# EAGLE schematic Control (EAGLE 6.4)
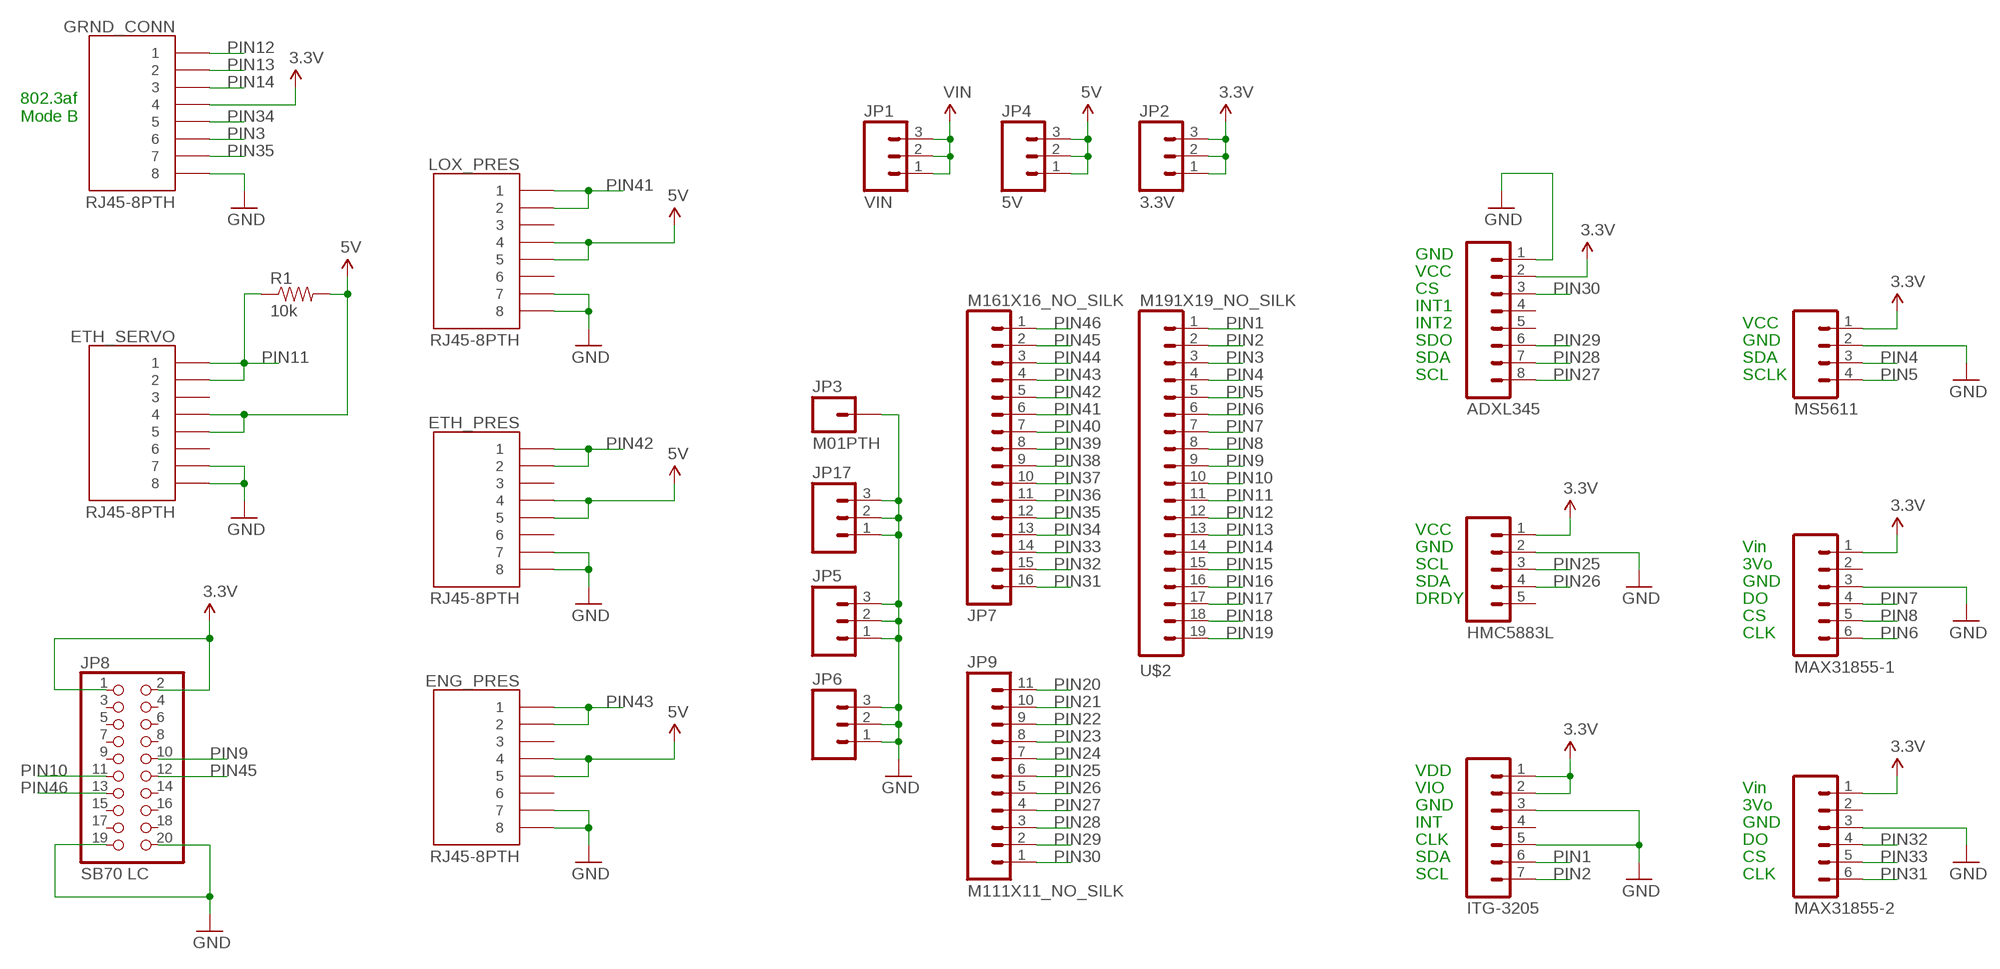
[diagram p0: schematic, sheet 1]

## Parts
ADXL345  M081X08  [1X08]
ENG_PRES  RJ45-8PTH  [RJ45-8]
ETH_PRES  RJ45-8PTH  [RJ45-8]
ETH_SERVO  RJ45-8PTH  [RJ45-8]
GRND_CONN  RJ45-8PTH  [RJ45-8]
HMC5883L  M05PTH  [1X05]
ITG-3205  M07  [1X07]
JP1  VIN  M03PTH  [1X03]
JP2  3.3V  M03PTH  [1X03]
JP3  M01PTH  [1X01]
JP4  5V  M03PTH  [1X03]
JP5  M03PTH  [1X03]
JP6  M03PTH  [1X03]
JP7  M161X16_NO_SILK  [1X16_NO_SILK]
JP8  SB70 LC  PINHD-2X10  [2X10]
JP9  M111X11_NO_SILK  [1X11_NO_SILK]
JP17  M03PTH  [1X03]
LOX_PRES  RJ45-8PTH  [RJ45-8]
MAX31855-1  M06SIP  [1X06]
MAX31855-2  M06SIP  [1X06]
MS5611  M041X04_NO_SILK  [1X04_NO_SILK]
R1  10k  RESISTORPTH-1/2W  [AXIAL-0.5]
U$2  M191X19_NO_SILK  [1X19_NO_SILK]

## Nets
3.3V: ADXL345.2 GRND_CONN.4 HMC5883L.1 ITG-3205.1 ITG-3205.2 JP2.1 JP2.2 JP2.3 JP8.1 JP8.2 MAX31855-1.1 MAX31855-2.1 MS5611.1
5V: ENG_PRES.4 ENG_PRES.5 ETH_PRES.4 ETH_PRES.5 ETH_SERVO.4 ETH_SERVO.5 JP4.1 JP4.2 JP4.3 LOX_PRES.4 LOX_PRES.5 R1.P$2
GND: ADXL345.1 ENG_PRES.7 ENG_PRES.8 ETH_PRES.7 ETH_PRES.8 ETH_SERVO.7 ETH_SERVO.8 GRND_CONN.8 HMC5883L.2 ITG-3205.3 ITG-3205.5 JP3.1 JP5.1 JP5.2 JP5.3 JP6.1 JP6.2 JP6.3 JP8.19 JP8.20 JP17.1 JP17.2 JP17.3 LOX_PRES.7 LOX_PRES.8 MAX31855-1.3 MAX31855-2.3 MS5611.2
PIN1: ITG-3205.6 U$2.1
PIN2: ITG-3205.7 U$2.2
PIN3: GRND_CONN.6 U$2.3
PIN4: MS5611.3 U$2.4
PIN5: MS5611.4 U$2.5
PIN6: MAX31855-1.6 U$2.6
PIN7: MAX31855-1.4 U$2.7
PIN8: MAX31855-1.5 U$2.8
PIN9: JP8.10 U$2.9
PIN10: JP8.11 U$2.10
PIN11: ETH_SERVO.1 ETH_SERVO.2 R1.P$1 U$2.11
PIN12: GRND_CONN.1 U$2.12
PIN13: GRND_CONN.2 U$2.13
PIN14: GRND_CONN.3 U$2.14
PIN15: U$2.15
PIN16: U$2.16
PIN17: U$2.17
PIN18: U$2.18
PIN19: U$2.19
PIN20: JP9.11
PIN21: JP9.10
PIN22: JP9.9
PIN23: JP9.8
PIN24: JP9.7
PIN25: HMC5883L.3 JP9.6
PIN26: HMC5883L.4 JP9.5
PIN27: ADXL345.8 JP9.4
PIN28: ADXL345.7 JP9.3
PIN29: ADXL345.6 JP9.2
PIN30: ADXL345.3 JP9.1
PIN31: JP7.16 MAX31855-2.6
PIN32: JP7.15 MAX31855-2.4
PIN33: JP7.14 MAX31855-2.5
PIN34: GRND_CONN.5 JP7.13
PIN35: GRND_CONN.7 JP7.12
PIN36: JP7.11
PIN37: JP7.10
PIN38: JP7.9
PIN39: JP7.8
PIN40: JP7.7
PIN41: JP7.6 LOX_PRES.1 LOX_PRES.2
PIN42: ETH_PRES.1 ETH_PRES.2 JP7.5
PIN43: ENG_PRES.1 ENG_PRES.2 JP7.4
PIN44: JP7.3
PIN45: JP7.2 JP8.12
PIN46: JP7.1 JP8.13
VIN: JP1.1 JP1.2 JP1.3
Unconnected: ADXL345.4 ADXL345.5 ENG_PRES.3 ENG_PRES.6 ETH_PRES.3 ETH_PRES.6 ETH_SERVO.3 ETH_SERVO.6 HMC5883L.5 ITG-3205.4 JP8.3 JP8.4 JP8.5 JP8.6 JP8.7 JP8.8 JP8.9 JP8.14 JP8.15 JP8.16 JP8.17 JP8.18 LOX_PRES.3 LOX_PRES.6 MAX31855-1.2 MAX31855-2.2

## Notes on the sheet
- 802.3af
  Mode B
- GND
- VCC
- CS
- INT1
- INT2 | VCC
- SDO | GND
- SDA | SDA
- SCL | SCLK
- VCC
- GND | Vin
- SCL | 3Vo
- SDA | GND
- DRDY | DO
- CS
- CLK
- VDD
- VIO | Vin
- GND | 3Vo
- INT | GND
- CLK | DO
- SDA | CS
- SCL | CLK

## Library data of the parts
ADXL345 = SparkFun-Connectors:M08: Header 8 Standard 8-pin 0.1" header. Use with straight break away headers (SKU : PRT-00116), right angle break away headers (PRT-00553), swiss pins (PRT-00743), machine pins (PRT-00117), and female headers (PRT-00115).
ENG_PRES ETH_PRES ETH_SERVO GRND_CONN LOX_PRES = SparkFun-Connectors:RJ45-8: RJ45 Jack Simple RJ45, 8-pin connection - connector for common Cat5, Cat5e, and Cat6 Ethernet cables. Footprint not yet proven in production. Connector sku is PRT-00643; Breakout PCB sku is BOB-00716.
HMC5883L = SparkFun-Connectors:M05: Header 5 Standard 5-pin 0.1" header. Use with straight break away headers (SKU : PRT-00116), right angle break away headers (PRT-00553), swiss pins (PRT-00743), machine pins (PRT-00117), and female headers (PRT-00115). Molex polarized connector foot print use with SKU : PRT-08230 with associated crimp pins and housings.
ITG-3205 = SparkFun-Connectors:M07: Header 7 Standard 7-pin 0.1" header. Use with straight break away headers (SKU : PRT-00116), right angle break away headers (PRT-00553), swiss pins (PRT-00743), machine pins (PRT-00117), and female headers (PRT-00115). NOTES ON THE VARIANTS LOCK and LOCK_LONGPADS... This footprint was designed to help hold the alignment of a through-hole component (i.e. 7-pin header) while soldering it into place. You may notice that each hole has been shifted either up or down by 0.005 of an inch from it's more standard position (which is usually a perfectly straight line). This slight alteration caused the pins (the squares in the middle) to touch the edges of the holes. Because they are alternating, it causes a "brace" to hold the header in place. 0.005 has proven to be the perfect amount of "off-center" position when using our standard breakaway headers. Although looks a little odd when you look at the bare footprint, once you have a header in there, the alteration is very hard to notice. Also, if you push a header all the way into place, it is covered up entirely on the bottom side. This idea of altering the position of holes to aid alignment will be further integrated into the Sparkfun Library for other footprints. It can help hold any component with 3 or more connection pins.
JP1 JP2 JP4-JP6 JP17 = SparkFun-Connectors:M03: Header 3 Standard 3-pin 0.1" header. Use with straight break away headers (SKU : PRT-00116), right angle break away headers (PRT-00553), swiss pins (PRT-00743), machine pins (PRT-00117), and female headers (PRT-00115). Molex polarized connector foot print use with SKU : PRT-08232 with associated crimp pins and housings.
JP3 = SparkFun-Connectors:M01: Header 1 Standard 1-pin 0.1" header. Use with straight break away headers (SKU : PRT-00116), right angle break away headers (PRT-00553), swiss pins (PRT-00743), machine pins (PRT-00117), and female headers (PRT-00115).
JP7 = SparkFun-Connectors:M16: 1x16 .1" header
JP8 = SparkFun-Connectors:PINHD-2X10: PIN HEADER
JP9 = SparkFun-Connectors:M11: Header 11 Standard 11-pin 0.1" header. Use with straight break away headers (SKU : PRT-00116), right angle break away headers (PRT-00553), swiss pins (PRT-00743), machine pins (PRT-00117), and female headers (PRT-00115).
MAX31855-1 MAX31855-2 = SparkFun-Connectors:M06: Header 6 Standard 6-pin 0.1" header. Use with straight break away headers (SKU : PRT-00116), right angle break away headers (PRT-00553), swiss pins (PRT-00743), machine pins (PRT-00117), and female headers (PRT-00115). Molex polarized connector foot print use with SKU : PRT-08094 with associated crimp pins and housings. NOTES ON THE VARIANTS LOCK and LOCK_LONGPADS... This footprint was designed to help hold the alignment of a through-hole component (i.e. 6-pin header) while soldering it into place. You may notice that each hole has been shifted either up or down by 0.005 of an inch from it's more standard position (which is a perfectly straight line). This slight alteration caused the pins (the squares in the middle) to touch the edges of the holes. Because they are alternating, it causes a "brace" to hold the component in place. 0.005 has proven to be the perfect amount of "off-center" position when using our standard breakaway headers. Although looks a little odd when you look at the bare footprint, once you have a header in there, the alteration is very hard to notice. Also, if you push a header all the way into place, it is covered up entirely on the bottom side. This idea of altering the position of holes to aid alignment will be further integrated into the Sparkfun Library for other footprints. It can help hold any component with 3 or more connection pins.
MS5611 = SparkFun-Connectors:M04: Header 4 Standard 4-pin 0.1" header. Use with straight break away headers (SKU : PRT-00116), right angle break away headers (PRT-00553), swiss pins (PRT-00743), machine pins (PRT-00117), and female headers (PRT-00115). Molex polarized connector foot print use with SKU : PRT-08231 with associated crimp pins and housings. 1MM SMD Version SKU: PRT-10208
R1 = SparkFun-Resistors:RESISTOR: Resistor Basic schematic elements and footprints for 0603, 1206, and PTH resistors.
U$2 = SparkFun-Connectors:M19: 1x19 .1" header

## Net classes
0 default: width 0.305 mm, drill 0.508 mm, clearance 0.381 mm